# EAGLE schematic 8051Clock (EAGLE 8.4.0)
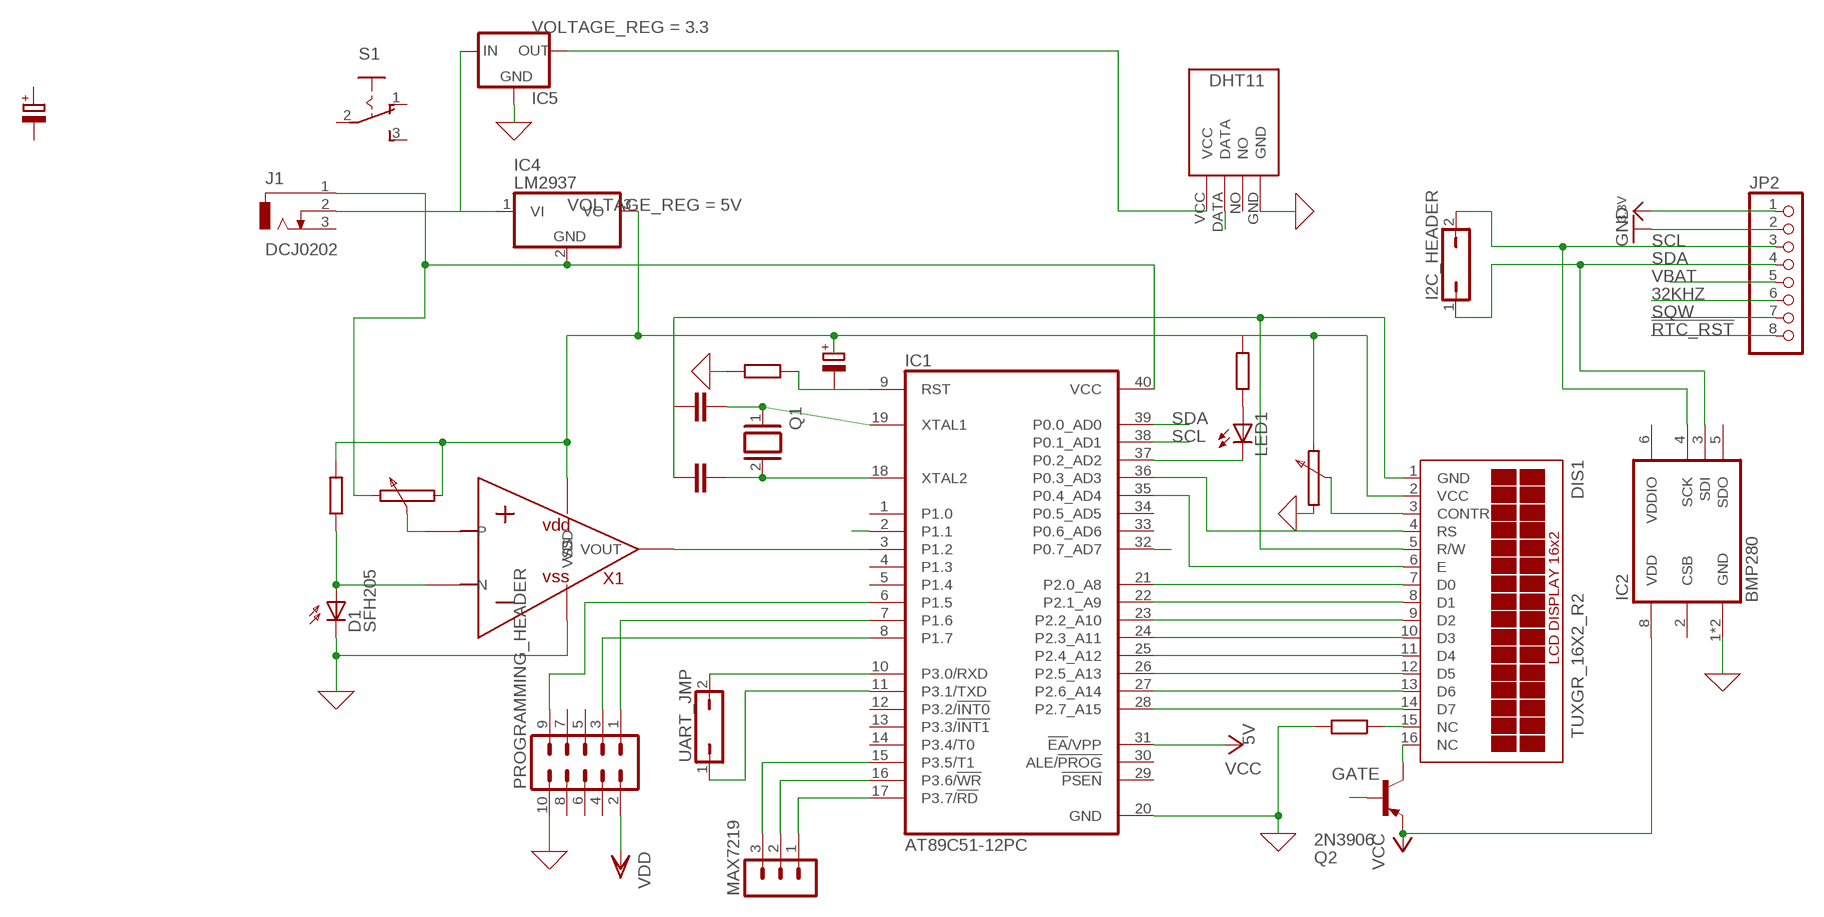
[diagram p0: schematic, sheet 1]

## Parts
D1  SFH205  [SFH205]
DIS1  TUXGR_16X2_R2  [TUXGR_16X2_R2]
I2C_HEADER  JP1Q  [JP1]
IC1  AT89C51-12PC  [DIL40]
IC2  BMP280  [BMP280]
IC4  LM2937  [TO263-3]
IC5  78LXX  [78LXX]
J1  DCJ0202  [DCJ0202]
JP2  HEADER-1X870MIL  [1X08_ROUND_70]
LED1  LED_ELD260  [LED_LD260]
MAX7219  MA03-1  [MA03-1]
PROGRAMMING_HEADER  MA05-2  [MA05-2]
Q1  XTAL/S  [QS]
Q2  2N3906  [TO92]
S1  255SB  [255SB]
U$1  DHT11-PION.  [DHT11-PION.]
UART_JMP  JP1Q  [JP1]
X1  OPAMP  (no package)

## Nets
0: D1.K(C) IC1.20(GND) IC2.1(GND) IC2.7(GND) IC5.GND PROGRAMMING_HEADER.10 U$1.GND X1.VSS ; supply symbol labelled GND
3.3V: JP2.1
32KHZ: JP2.6
!RTC_RST: JP2.8
CLK: IC1.15(P3.5/T1) MAX7219.3
CS: IC1.16(P3.6/!WR) MAX7219.2
DATA: IC1.32(P0.7_AD7) U$1.DATA
DIN: IC1.17(P3.7/!RD) MAX7219.1
GATE: IC1.2(P1.1) Q2.2(B)
GND: JP2.2
N$1: DIS1.1(GND) DIS1.5(R/W)
N$2: X1.P
N$3: DIS1.7(D0) IC1.21(P2.0_A8)
N$4: DIS1.8(D1) IC1.22(P2.1_A9)
N$5: DIS1.9(D2) IC1.23(P2.2_A10)
N$6: DIS1.10(D3) IC1.24(P2.3_A11)
N$7: DIS1.11(D4) IC1.25(P2.4_A12)
N$8: DIS1.12(D5) IC1.26(P2.5_A13)
N$9: DIS1.13(D6) IC1.27(P2.6_A14)
N$10: DIS1.14(D7) IC1.28(P2.7_A15)
N$11: IC1.19(XTAL1) Q1.1
N$12: IC1.18(XTAL2) Q1.2
N$13: DIS1.4(RS) IC1.36(P0.3_AD3)
N$14: DIS1.3(CONTR)
N$15: DIS1.6(E) IC1.35(P0.4_AD4)
N$16: IC1.3(P1.2) X1.VOUT
N$17: D1.A X1.N
N$18: IC1.40(VCC) IC4.2(GND) J1.1
N$19: DIS1.2(VCC) IC4.3(VO) X1.VDD
N$20: DIS1.15(NC)
N$21: IC1.10(P3.0/RXD) UART_JMP.2
N$22: IC1.11(P3.1/TXD) UART_JMP.1
N$23: DIS1.16(NC) Q2.1(C)
N$24: IC1.9(RST)
N$25: IC4.1(VI) IC5.IN J1.2
N$26: IC5.OUT U$1.VCC
N$27: IC1.6(P1.5) PROGRAMMING_HEADER.9
N$28: IC1.7(P1.6) PROGRAMMING_HEADER.1
N$29: IC1.8(P1.7) PROGRAMMING_HEADER.3
N$30: IC1.37(P0.2_AD2) LED1.K(C)
SCL: I2C_HEADER.2 IC1.38(P0.1_AD1) IC2.4(SCK) JP2.3
SDA: I2C_HEADER.1 IC1.39(P0.0_AD0) IC2.3(SDI) JP2.4
SQW: JP2.7
VBAT: JP2.5
VCC: IC1.31(!EA!/VPP) IC2.8(VDD) Q2.3(E)
VDD: PROGRAMMING_HEADER.2
Unconnected: IC1.1(P1.0) IC1.4(P1.3) IC1.5(P1.4) IC1.12(P3.2/!INT0) IC1.13(P3.3/!INT1) IC1.14(P3.4/T0) IC1.29(!PSEN) IC1.30(ALE/!PROG) IC1.33(P0.6_AD6) IC1.34(P0.5_AD5) IC2.2(CSB) IC2.5(SDO) J1.3 LED1.A PROGRAMMING_HEADER.4 PROGRAMMING_HEADER.5 PROGRAMMING_HEADER.6 PROGRAMMING_HEADER.7 PROGRAMMING_HEADER.8 S1.1(O) S1.2(P) S1.3(S) U$1.NO

## Power pins joined to a net without a drawn wire
VDDIO: IC2.6(VDDIO)

## Library data of the parts
D1 = opto-trans-siemens:SFH205: PHOTO DIODE; OC_FARNELL: unknown; OC_NEWARK: unknown
DIS1 = display-lcd:TUXGR_16X2_R2: Tuxgraphics LCD display 16x2 characters reflective, without background light Source: tuxgr_12x2_r2.pdf; OC_FARNELL: unknown; OC_NEWARK: unknown
I2C_HEADER UART_JMP = jumper:JP1Q: JUMPER
IC1 = atmel:AT89C51-*: 8-bit Microcontroller with 4K Bytes Flash Not Recommended for New Designs. Use AT89S51. Source: http://www.atmel.com/dyn/resources/prod_documents/doc0265.; OC_FARNELL: unknown; OC_NEWARK: unknown
IC2 = bosch-bmp280:BMP280: The BMP280 is an absolute barometric pressure sensor especially designed for mobile applications. The sensor module is housed in an extremely compact 8-pin metal-lid LGA package with a footprint of only 2.0 × 2.5 mm2 and 0.95 mm package height. Its small dimensions and its low power consumption of 2.7 μA @1Hz allow the implementation in battery driven devices such as mobile phones, GPS modules or watches. The library has been designed by Richard Magdycz <https://www.facebook.com/groups/eaglecadsoftUK>
IC4 = linear:LM2937: LM2937-2.5, LM2937-3.3 400mA and 500mA Voltage Regulators Source: http://cache.national.com/ds/LM/LM2937-2.5.pdf; VOLTAGE_REG: 5V
IC5 = v-reg:78LXX: VOLTAGE REGULATOR; VOLTAGE_REG: 3.3
J1 = con-jack:DCJ0202: DC POWER JACK Source: DCJ0202.pdf; OC_FARNELL: unknown; OC_NEWARK: unknown
JP2 = microbuilder:HEADER-1X8: PIN HEADER
LED1 = eagle-ltspice:LED_E: LED Source: http://www.osram.convergy.de Source: www.luxeon.com Source: www.kingbright.com; SPICEMODEL: NONE; SPICEPREFIX: D; SPICETYPE: diode
MAX7219 = con-lstb:MA03-1: PIN HEADER; OC_FARNELL: unknown; OC_NEWARK: unknown
PROGRAMMING_HEADER = con-lstb:MA05-2: PIN HEADER; OC_FARNELL: unknown; OC_NEWARK: unknown
Q1 = special:XTAL/S: CRYSTAL
Q2 = transistor-pnp:2N3906: PNP Transistor
S1 = switch:255SB: SLIDING SWITCH Distributor Buerklin, 11G810
U$1 = DHT11:DHT11-PION.: DHT11 Czujnik temperatury i wilgotności (widok pionowy)
X1 = ngspice-simulation:OPAMP: Operational amplifier with power pins